# EAGLE design coil-driver-35 (EAGLE 4.16)
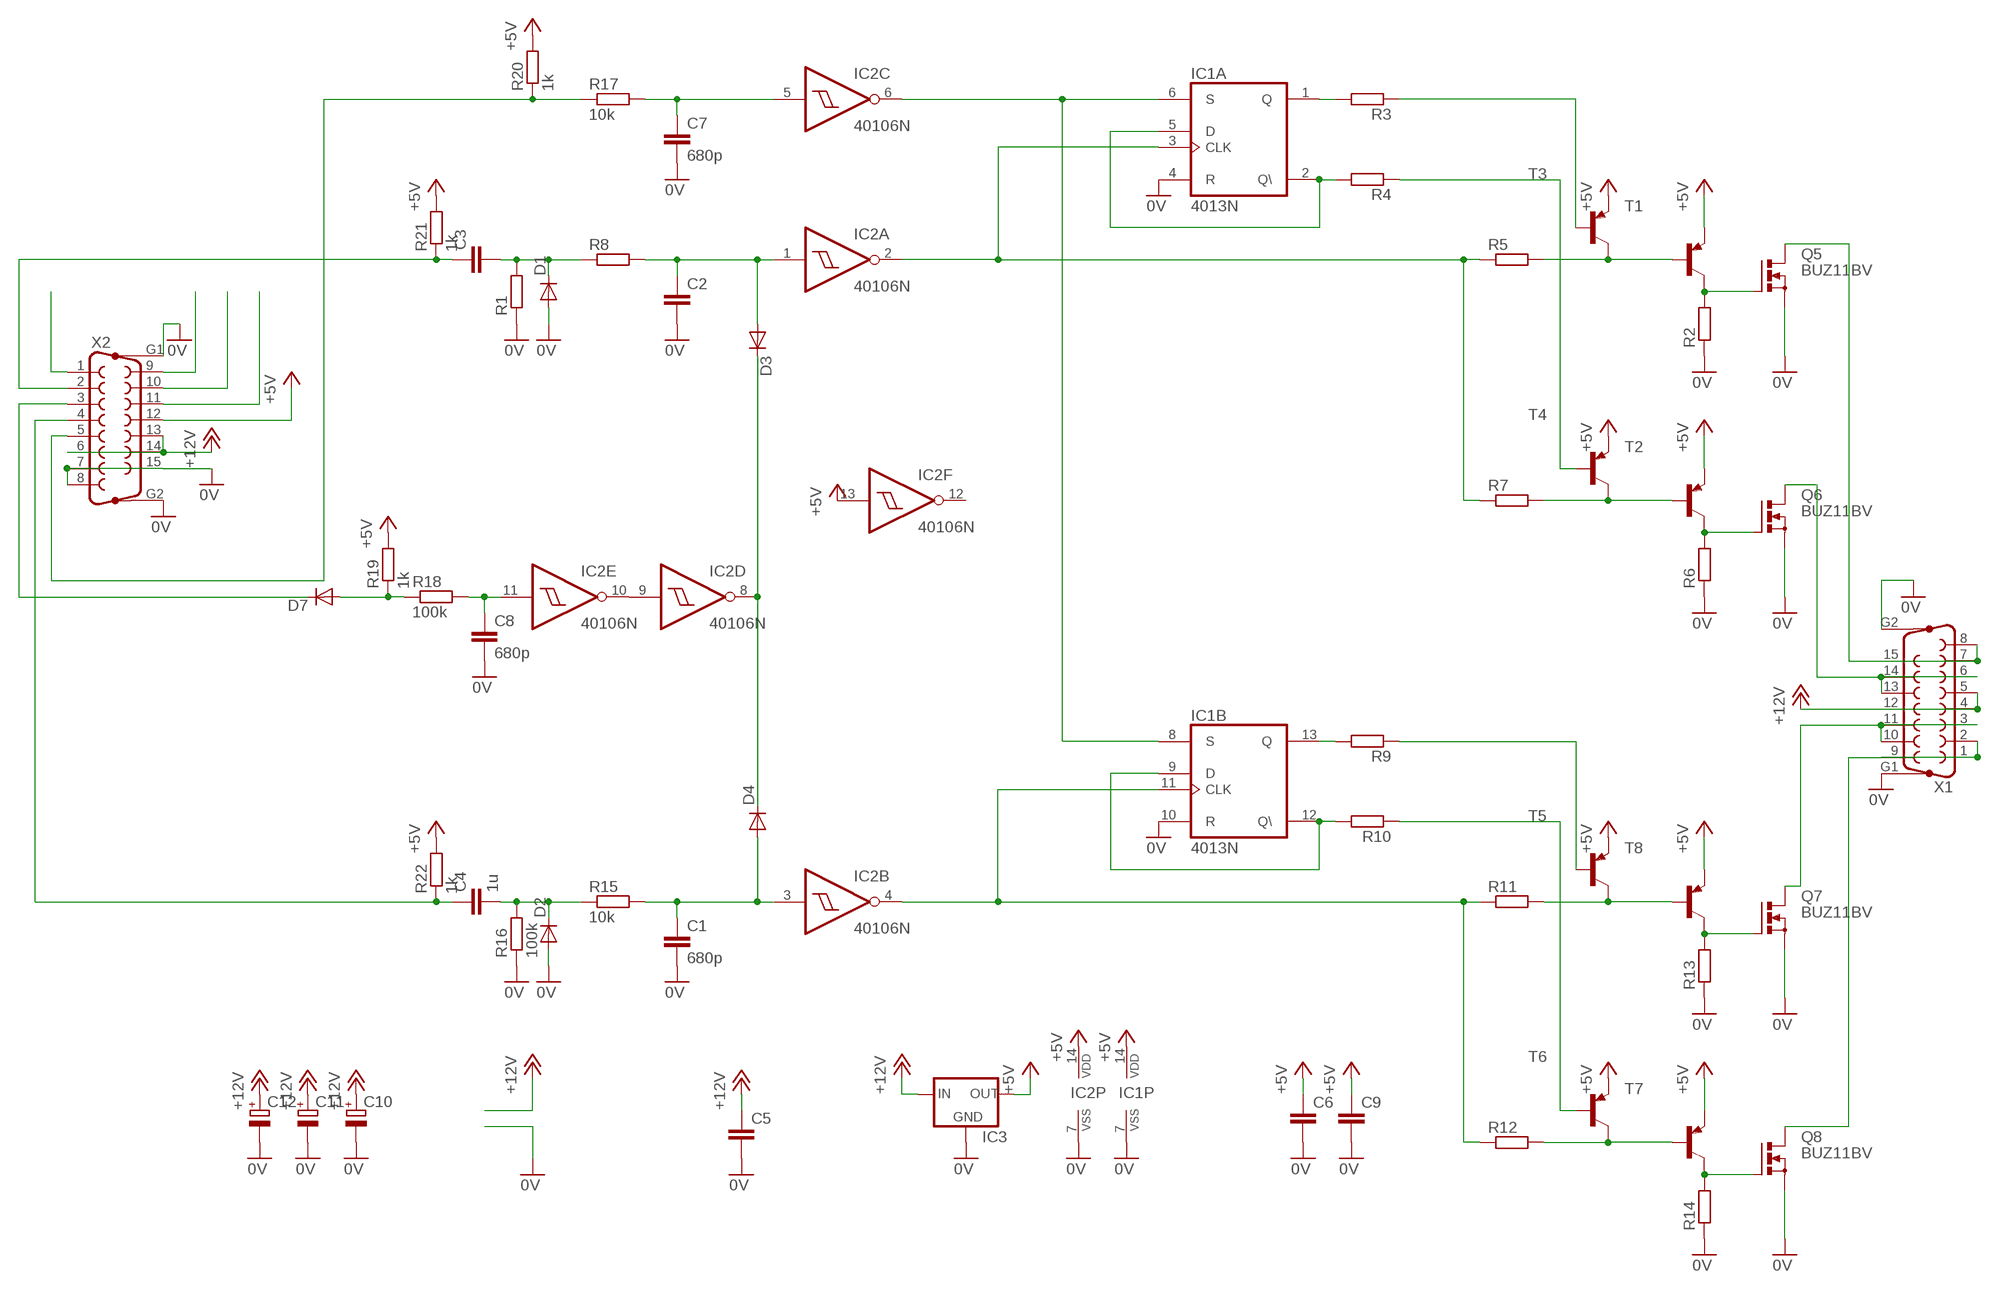
[diagram p0: schematic, sheet 1]

## Parts
C1  680p  C-EU050-030X075  [C050-030X075]
C2  C-EU050-030X075  [C050-030X075]
C3  C-EU050-030X075  [C050-030X075]
C4  1u  C-EU050-030X075  [C050-030X075]
C5  C-EU050-030X075  [C050-030X075]
C6  C-EU050-030X075  [C050-030X075]
C7  680p  C-EU050-030X075  [C050-030X075]
C8  680p  C-EU050-030X075  [C050-030X075]
C9  C-EU050-030X075  [C050-030X075]
C10  CPOL-EUE5-6  [E5-6]
C11  CPOL-EUE5-6  [E5-6]
C12  CPOL-EUE5-6  [E5-6]
D1  DIODE-D-7.5  [D-7.5]
D2  DIODE-D-7.5  [D-7.5]
D3  DIODE-D-7.5  [D-7.5]
D4  DIODE-D-7.5  [D-7.5]
D7  DIODE-D-7.5  [D-7.5]
IC1  4013N  [DIL14]
IC2  40106N  [DIL14]
IC3  78XXS  [78XXS]
Q5  BUZ11BV  [TO220BV]
Q6  BUZ11BV  [TO220BV]
Q7  BUZ11BV  [TO220BV]
Q8  BUZ11BV  [TO220BV]
R1  R-EU_0207/7  [0207/7]
R2  R-EU_0207/5V  [0207/5V]
R3  R-EU_0207/7  [0207/7]
R4  R-EU_0207/7  [0207/7]
R5  R-EU_0207/7  [0207/7]
R6  R-EU_0207/5V  [0207/5V]
R7  R-EU_0207/7  [0207/7]
R8  R-EU_0207/7  [0207/7]
R9  R-EU_0207/7  [0207/7]
R10  R-EU_0207/7  [0207/7]
R11  R-EU_0207/7  [0207/7]
R12  R-EU_0207/7  [0207/7]
R13  R-EU_0207/5V  [0207/5V]
R14  R-EU_0207/5V  [0207/5V]
R15  10k  R-EU_0207/7  [0207/7]
R16  100k  R-EU_0207/7  [0207/7]
R17  10k  R-EU_0207/7  [0207/7]
R18  100k  R-EU_0207/7  [0207/7]
R19  1k  R-EU_0207/7  [0207/7]
R20  1k  R-EU_0207/7  [0207/7]
R21  1k  R-EU_0207/7  [0207/7]
R22  1k  R-EU_0207/7  [0207/7]
T1  BC557B-PNP-TO92-EBC  [TO92-EBC]
T2  BC557B-PNP-TO92-EBC  [TO92-EBC]
T3  BC557B-PNP-TO92-EBC  [TO92-EBC]
T4  BC557B-PNP-TO92-EBC  [TO92-EBC]
T5  BC557B-PNP-TO92-EBC  [TO92-EBC]
T6  BC557B-PNP-TO92-EBC  [TO92-EBC]
T7  BC557B-PNP-TO92-EBC  [TO92-EBC]
T8  BC557B-PNP-TO92-EBC  [TO92-EBC]
X1  F15HP  [F15HP]
X2  F15HP  [F15HP]

## Nets
0V: C1.2 C2.2 C5.2 C6.2 C7.2 C8.2 C9.2 C10.- C11.- C12.- D1.A D2.A IC1.4(A:R) IC1.7(P:VSS) IC1.10(B:R) IC2.7(P:VSS) IC3.GND Q5.S Q6.S Q7.S Q8.S R1.1 R2.1 R6.1 R13.1 R14.1 R16.1 X1.G1 X1.G2 X2.7 X2.8 X2.15 X2.G1 X2.G2
+5V: C6.1 C9.1 IC1.14(P:VDD) IC2.13(F:I) IC2.14(P:VDD) IC3.OUT R19.2 R20.2 R21.2 R22.2 T1.E T2.E T3.E T4.E T5.E T6.E T7.E T8.E X2.12
+12V: C5.1 C10.+ C11.+ C12.+ IC3.IN X1.4 X1.5 X1.12 X2.6 X2.13 X2.14
N$1: Q5.G R2.2 T1.C
N$3: IC1.1(A:Q) R3.2
N$4: IC1.2(A:Q\) IC1.5(A:D) R4.2
N$5: R3.1 T3.B
N$6: IC1.3(A:CLK) IC2.2(A:O) R5.1 R7.1
N$8: C2.1 D3.A IC2.1(A:I) R8.2
N$9: Q6.G R6.2 T2.C
N$10: R4.1 T4.B
N$11: R5.2 T1.B T3.C
N$12: IC1.11(B:CLK) IC2.4(B:O) R11.1 R12.1
N$13: IC1.13(B:Q) R9.2
N$14: R7.2 T2.B T4.C
N$15: C3.2 D1.C R1.2 R8.1
N$16: IC1.9(B:D) IC1.12(B:Q\) R10.2
N$17: R9.1 T5.B
N$18: R10.1 T6.B
N$19: Q7.G R13.2 T8.C
N$20: R11.2 T5.C T8.B
N$21: R12.2 T6.C T7.B
N$22: Q8.G R14.2 T7.C
N$24: Q8.D X1.1 X1.2 X1.9
N$25: C4.2 D2.C R15.1 R16.2
N$26: C1.1 D4.A IC2.3(B:I) R15.2
N$27: C4.1 R22.1 X2.4
N$28: C3.1 R21.1 X2.2
N$29: IC1.6(A:S) IC1.8(B:S) IC2.6(C:O)
N$30: C7.1 IC2.5(C:I) R17.2
N$31: Q7.D X1.3 X1.10 X1.11
N$32: R17.1 R20.1 X2.5
N$35: Q6.D X1.6 X1.13 X1.14
N$36: Q5.D X1.7 X1.8 X1.15
N$37: IC2.9(D:I) IC2.10(E:O)
N$38: D7.C X2.3
N$39: C8.1 IC2.11(E:I) R18.2
N$40: D3.C D4.C IC2.8(D:O)
N$46: D7.A R18.1 R19.1
N$50: X2.9
N$51: X2.10
N$52: X2.11
N$53: X2.1
Unconnected: IC2.12(F:O)

## Library data of the parts
C1-C9 = rcl:C-EU: CAPACITOR, European symbol
C10-C12 = rcl:CPOL-EU: POLARIZED CAPACITOR, European symbol
D1-D4 D7 = diode:DIODE-: DIODE
IC1 = 40xx:4013: Dual D FLIP FLOP, set/reset
IC2 = 40xx:40106: Hex SCHMITT TRIGGER
IC3 = v-reg:78XXS: VOLTAGE REGULATOR
Q5-Q8 = transistor-power:BUZ11: N-CHANNEL MOS FET
R1-R22 = rcl:R-EU_: RESISTOR, European symbol
T1-T8 = transistor:*-PNP-: PNP Transistror
X1 X2 = con-subd:F15HP: SUB-D

## Board
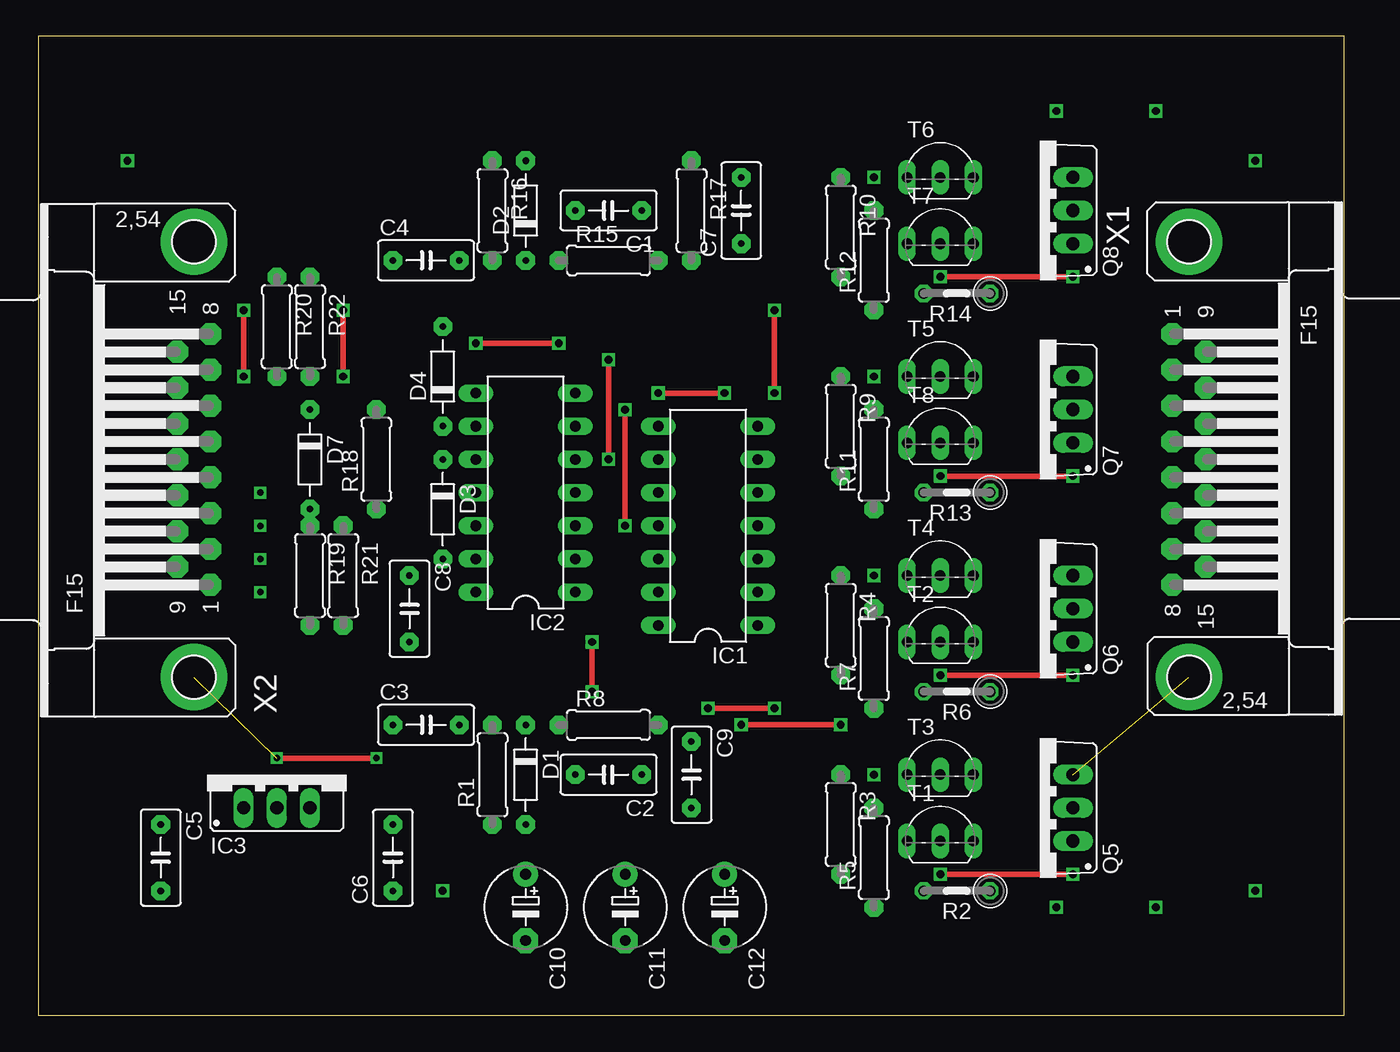
[diagram p1: board, top side]
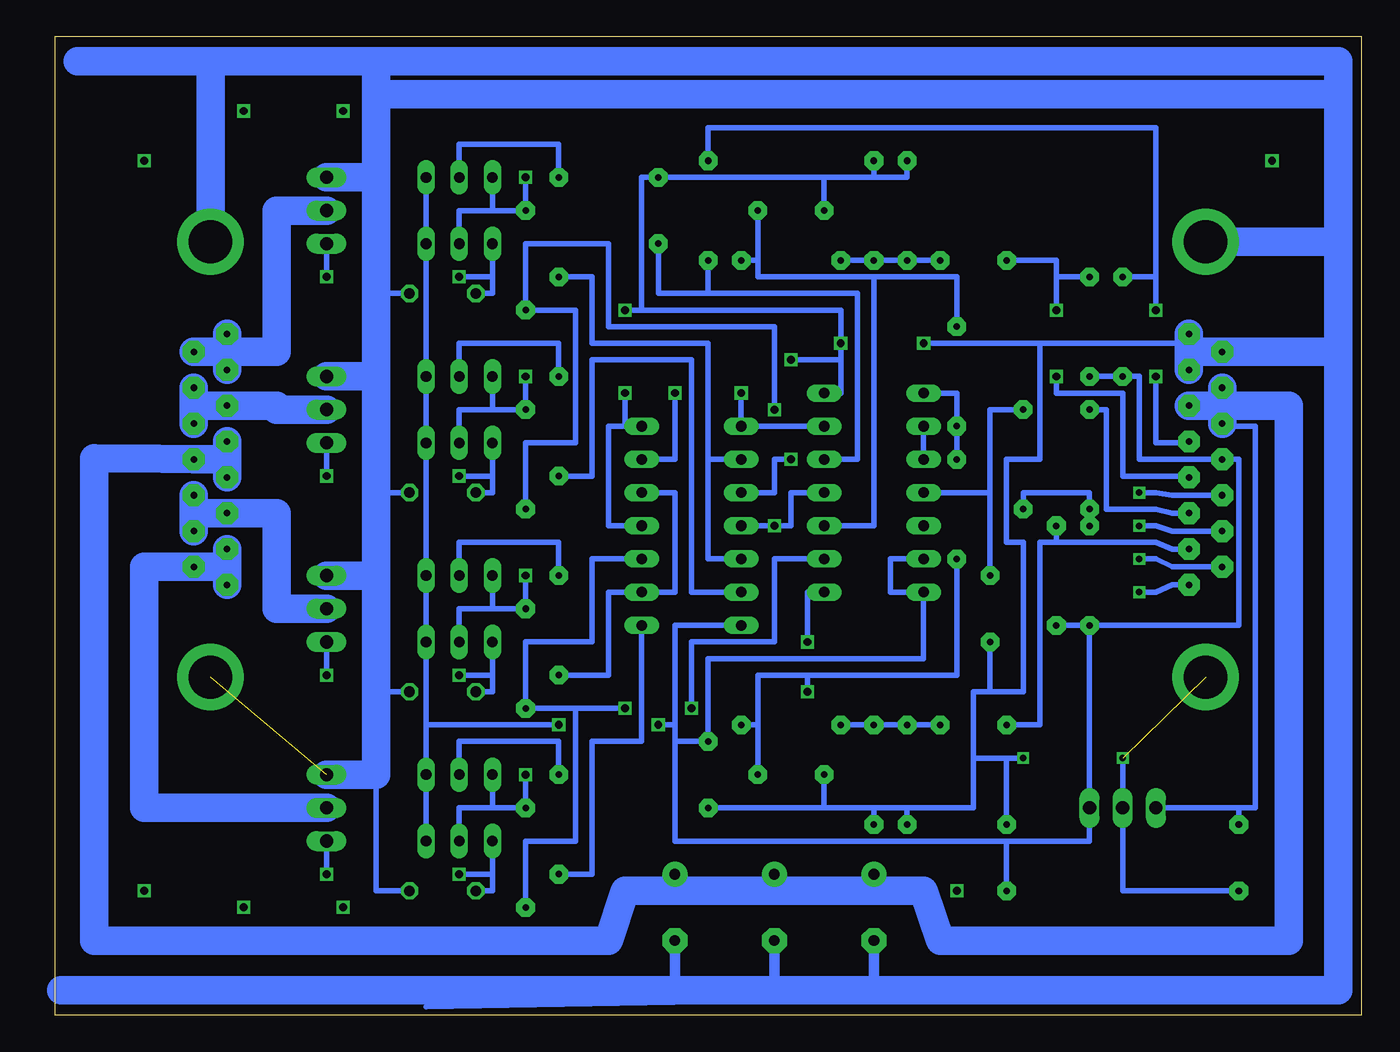
[diagram p2: board, bottom side, seen from below]

Size 100 x 74.92 mm. Coordinates in mm from the lower left corner, seen from the top.
Outline: 0,0 100,0 100,74.92 0,74.92 0,0
Copper layers (1*16): Top 0.035mm / dielectric 1.5mm / Bottom 0.035mm
Design rules "default": minimum track width 10mil, minimum drill 24mil, track to track 8mil, track to pad 8mil, pad to pad 8mil, via to via 8mil, smd to smd 8mil, copper to edge 40mil, drill to drill 8mil, minimum pad ring 10mil, minimum via ring 8mil, stop-mask expansion 4mil, vias tented up to drill 0mil, thermal gap 10mil
tKeepout: area 0.5,70.5 to 99.5,75.6; area 0.5,-0.6 to 99.5,4.4

### Footprints (pad centres in the part's own frame; a part is rotated, then mirrored left to right if it is on the bottom)
C050-030X075 = drill 0.5 pad 1.422 octagon: 1 -2.54,0; 2 2.54,0
E5-6 = drill 0.813 pad 1.905 round: + -2.54,0 | drill 0.813 pad 1.905 octagon: - 2.54,0
D-7.5 = drill 0.5 pad 1.422 octagon: A 3.81,0; C -3.81,0
DIL14 = drill 0.813 long: 1 -7.62,-3.81; 2 -5.08,-3.81; 3 -2.54,-3.81; 4 0,-3.81; 5 2.54,-3.81; 6 5.08,-3.81; 7 7.62,-3.81; 8 7.62,3.81; 9 5.08,3.81; 10 2.54,3.81; 11 0,3.81; 12 -2.54,3.81; 13 -5.08,3.81; 14 -7.62,3.81
78XXS = drill 1.016 long: GND 0,-2.54; IN -2.54,-2.54; OUT 2.54,-2.54
TO220BV = drill 1.016 long: D 0,-2.54; G -2.54,-2.54; S 2.54,-2.54
0207/7 = drill 0.5 pad 1.422 octagon: 1 -3.81,0; 2 3.81,0
0207/5V = drill 0.813 octagon: 1 -2.54,0; 2 2.54,0
TO92-EBC = drill 0.813 long: B 0,-1.27; C -2.54,-1.27; E 2.54,-1.27
F15HP = drill 0.5 pad 1.676 octagon: 1 -9.601,-1.27; 2 -6.858,-1.27; 3 -4.115,-1.27; 4 -1.372,-1.27; 5 1.372,-1.27; 6 4.115,-1.27; 7 6.858,-1.27; 8 9.601,-1.27; 9 -8.23,1.27; 10 -5.486,1.27; 11 -2.743,1.27; 12 0,1.27; 13 2.743,1.27; 14 5.486,1.27; 15 8.23,1.27 | drill 3.302 pad 5.08 round: G1 -16.662,0; G2 16.662,0

### Placement (x,y rotation side)
C1  43.65,61.59 180 top
C2  43.65,18.41 180 top
C3  29.68,22.22 0 top
C4  29.68,57.78 0 top
C5  9.36,12.06 270 top
C6  27.14,12.06 90 top
C7  53.81,61.59 90 top
C8  28.41,31.11 270 top
C9  50,18.41 270 top
C10  37.3,8.25 270 top
C11  44.92,8.25 270 top
C12  52.54,8.25 270 top
D1  37.3,18.41 270 top
D2  37.3,61.59 90 top
D3  30.95,38.73 270 top
D4  30.95,48.89 90 top
D7  20.79,42.54 270 top
IC1  51.27,37.46 90 top
IC2  37.3,40 90 top
IC3  18.25,18.41 0 top
Q5  76.67,15.87 90 top
Q6  76.67,31.11 90 top
Q7  76.67,46.35 90 top
Q8  76.67,61.59 90 top
R1  34.76,18.41 90 top
R2  70.32,9.52 180 top
R3  61.43,14.6 270 top
R4  61.43,29.84 270 top
R5  63.97,12.06 90 top
R6  70.32,24.76 180 top
R7  63.97,27.3 90 top
R8  43.65,22.22 0 top
R9  61.43,45.08 270 top
R10  61.43,60.32 270 top
R11  63.97,42.54 90 top
R12  63.97,57.78 90 top
R13  70.32,40 180 top
R14  70.32,55.24 180 top
R15  43.65,57.78 0 top
R16  34.76,61.59 270 top
R17  50,61.59 270 top
R18  25.87,42.54 90 top
R19  20.79,33.65 270 top
R20  18.25,52.7 270 top
R21  23.33,33.65 270 top
R22  20.79,52.7 270 top
T1  69.05,14.6 0 top
T2  69.05,29.84 0 top
T3  69.05,19.68 0 top
T4  69.05,34.92 0 top
T5  69.05,50.16 0 top
T6  69.05,65.4 0 top
T7  69.05,60.32 0 top
T8  69.05,45.08 0 top
X1  88.1,42.54 270 top
X2  11.9,42.54 90 top

### Tracks (layer width: path | path; a pad name or v marks a point on that pad's centre or on a via)
0V  (via drill 0.5, 0.6)  (2 unrouted)
  Top 0.406: v56.35,53.97 v56.35,47.62 | v33.49,51.43 v39.84,51.43 | v25.87,19.68 v18.25,19.68 | v43.65,50.16 v43.65,42.54
  Bottom 0.406: 37.3,64.13 34.76,64.13 R16.1 | 41.11,64.13 37.3,64.13 | 37.3,64.13 D2.A | 34.76,15.87 37.3,15.87 | 37.3,15.87 41.11,15.87 | 41.11,15.87 C2.2 | 34.76,15.87 R1.1 | 37.3,15.87 D1.A | X2.7 13.17,48.89 | 1.74,1.9 71.59,0.63 | 1.74,51.43 1.74,50.77 | 13.17,50.77 13.17,51.43 24.6,51.43 | 1.74,59.05 1.74,59.2 | C5.2 18.25,9.52 IC3.GND v18.25,19.68 | 75.4,55.24 R14.1 | 75.4,40 R13.1 | 75.4,24.76 R6.1 | R2.1 75.4,9.52 75.4,18.41 | IC1.4 57.62,37.46 57.62,45.08 IC1.7 56.35,45.08 v56.35,47.62 | 28.41,24.76 25.87,24.76 25.87,36.19 27.14,36.19 27.14,42.54 24.6,42.54 24.6,51.43 | 28.41,24.76 C8.2 | 28.41,24.76 29.68,24.76 29.68,19.68 | 34.76,15.87 29.68,15.87 29.68,19.68 | 41.11,64.13 C1.2 | 41.11,64.13 C7.2 55.08,64.13 55.08,53.97 v56.35,53.97 39.84,53.97 v39.84,51.43 39.84,50.16 | 41.11,15.87 C9.2 | 29.68,19.68 27.14,19.68 | 27.14,19.68 v25.87,19.68 | 27.14,19.68 C6.2 | IC2.7 39.84,47.62 39.84,50.16 | IC1.10 44.92,40 44.92,42.54 v43.65,42.54 | 39.84,50.16 v43.65,50.16 | 24.6,51.43 v33.49,51.43
  Bottom 0.813: 37.3,1.9 C10.- | 44.92,1.9 C11.- | 52.54,1.9 C12.-
  Bottom 2.184: 75.4,33.65 75.4,24.76 75.4,18.41 Q5.S | 75.4,48.89 75.4,40 75.4,33.65 | 75.4,64.13 75.4,55.24 75.4,48.89 | 75.4,64.13 Q8.S | 75.4,48.89 Q7.S | 75.4,33.65 Q6.S | X2.7 13.17,51.43 X2.8 | 75.4,73.02 1.74,73.02 1.74,70.48 | 75.4,70.48 75.4,73.02 | 75.4,70.48 75.4,64.13 | 88.1,73.02 98.26,73.02 | 1.74,70.48 1.74,59.05 1.74,51.43 1.74,1.9 37.3,1.9 44.92,1.9 52.54,1.9 99.53,1.9 | 1.74,50.77 X2.15 13.17,50.77 | 1.74,59.2 X2.G2 | 75.4,73.02 88.1,73.02 | 88.1,73.02 X1.G1 | 1.74,70.48 75.4,70.48
+5V  (via drill 0.6)
  Top 0.406: v53.81,22.22 v61.43,22.22
  Bottom 0.406: T7.E T6.E T7.E | T8.E T5.E | T5.E T7.E | IC1.14 52.54,29.84 52.54,22.22 | T1.E T3.E 71.59,22.22 | T4.E T2.E 71.59,22.22 | T4.E T8.E | 52.54,20.95 52.54,13.33 27.14,13.33 | 52.54,20.95 52.54,22.22 | 27.14,13.33 20.79,13.33 IC3.OUT R19.2 | R19.2 9.36,29.84 9.36,42.54 X2.12 16.98,42.54 16.98,48.89 R20.2 R22.2 | 52.54,20.95 C9.1 50,27.3 33.49,27.3 IC2.14 36.03,32.38 36.03,34.92 IC2.13 | v61.43,22.22 71.59,22.22 | 52.54,22.22 v53.81,22.22 | T8.E T5.E | T4.E T5.E | 27.14,13.33 C6.1 | R19.2 R21.2
+12V
  Bottom 0.406: X2.6 13.17,46.35 | 8.09,15.87 9.36,15.87 C5.1 | 8.09,15.87 IC3.IN | 8.09,15.87 8.09,45.08 10.63,45.08 X2.13
  Bottom 0.813: 37.3,9.52 C10.+ | 44.92,9.52 C11.+ | 52.54,9.52 C12.+
  Bottom 2.184: 86.83,42.54 X1.5 | 86.83,42.54 X1.12 | 86.83,42.54 96.99,42.64 96.99,5.71 57.62,5.71 56.35,9.52 52.54,9.52 44.92,9.52 37.3,9.52 33.49,9.52 32.22,5.71 5.55,5.71 5.55,46.66 X2.6 10.63,46.66 10.63,46.35 | 86.83,42.54 X1.4 | 10.63,46.35 X2.13 | 10.63,46.35 X2.14
N$1  (via drill 0.6)
  Top 0.406: v69.05,10.79 v79.21,10.79
  Bottom 0.406: v79.21,10.79 Q5.G | R2.2 66.51,9.52 66.51,10.79 | 66.51,10.79 v69.05,10.79 | 66.51,10.79 T1.C
N$2  (via drill 0.6)
  other vias: 77.94,8.25
N$3
  Bottom 0.406: R3.2 58.89,10.79 58.89,20.95 55.08,20.95 IC1.1
N$4
  Bottom 0.406: R4.2 57.62,26.03 57.62,32.38 IC1.2 52.54,32.38 52.54,40 IC1.5
N$5
  Bottom 0.406: T3.B 69.05,20.95 61.43,20.95 R3.1
N$6  (via drill 0.6)
  Top 0.406: v56.35,23.49 v51.27,23.49
  Bottom 0.406: IC1.3 58.89,34.92 58.89,28.57 63.97,28.57 R7.1 | R7.1 v56.35,23.49 | v51.27,23.49 51.27,28.57 44.92,28.57 44.92,34.92 IC2.2 | R7.1 60.16,23.49 60.16,13.33 63.97,13.33 R5.1
N$7  (via drill 0.6)
  other vias: 85.56,8.25
N$8  (via drill 0.6)
  Top 0.406: v42.38,24.76 v42.38,28.57
  Bottom 0.406: 46.19,22.22 C2.1 | 46.19,22.22 R8.2 | 46.19,22.22 46.19,26.03 42.38,26.03 | D3.A 30.95,26.03 42.38,26.03 | IC2.1 42.38,32.38 v42.38,28.57 | 42.38,26.03 v42.38,24.76
N$9  (via drill 0.6)
  Top 0.406: v69.05,26.03 v79.21,26.03
  Bottom 0.406: 66.51,26.03 T2.C | v79.21,26.03 Q6.G | 66.51,26.03 v69.05,26.03 | R6.2 66.51,24.76 66.51,26.03
N$10
  Bottom 0.406: T4.B 69.05,36.19 61.43,36.19 R4.1
N$11  (via drill 0.6)
  Bottom 0.406: 66.51,15.87 T3.C | 66.51,15.87 69.05,15.87 T1.B | 66.51,15.87 R5.2 v63.97,18.41
N$12  (via drill 0.6)
  Top 0.406: v44.92,37.46 v44.92,46.35
  Bottom 0.406: v44.92,46.35 44.92,52.7 57.62,52.7 57.62,59.05 63.97,59.05 R12.1 60.16,53.97 60.16,43.81 63.97,43.81 R11.1 | IC1.11 v44.92,37.46 43.65,37.46 43.65,40 IC2.4
N$13
  Bottom 0.406: R9.2 58.89,41.27 58.89,50.16 51.27,50.16 51.27,32.38 IC1.13
N$14  (via drill 0.6)
  Bottom 0.406: 66.51,31.11 T4.C | 66.51,31.11 69.05,31.11 T2.B | 66.51,31.11 R7.2 v63.97,33.65
N$15
  Bottom 0.406: R1.2 38.57,22.22 | C3.2 R1.2 | R1.2 D1.C R8.1
N$16
  Bottom 0.406: 50,42.54 50,51.43 58.89,51.43 58.89,56.51 R10.2 | 50,42.54 IC1.9 | IC1.12 50,34.92 50,42.54
N$17
  Bottom 0.406: T5.B 69.05,51.43 61.43,51.43 R9.1
N$18
  Bottom 0.406: T6.B 69.05,66.67 61.43,66.67 R10.1
N$19  (via drill 0.6)
  Top 0.406: v69.05,41.27 v79.21,41.27
  Bottom 0.406: v79.21,41.27 Q7.G | R13.2 66.51,40 66.51,41.27 | 66.51,41.27 T8.C | 66.51,41.27 v69.05,41.27
N$20  (via drill 0.6)
  Bottom 0.406: 66.51,46.35 T5.C | 66.51,46.35 69.05,46.35 T8.B | 66.51,46.35 R11.2 v63.97,48.89
N$21  (via drill 0.6)
  Bottom 0.406: 66.51,61.59 T6.C | 66.51,61.59 69.05,61.59 T7.B | 66.51,61.59 R12.2 v63.97,64.13
N$22  (via drill 0.6)
  Top 0.406: v69.05,56.51 v79.21,56.51
  Bottom 0.406: v79.21,56.51 Q8.G | R14.2 66.51,55.24 66.51,56.51 | 66.51,56.51 T7.C | 66.51,56.51 v69.05,56.51
N$23  (via drill 0.6)
  other vias: 77.94,69.21
N$24
  Bottom 2.184: Q8.D 83.02,61.59 83.02,50.77 X1.9 86.83,50.77 86.83,51.43 | 86.83,51.43 X1.2 | 86.83,51.43 X1.1
N$25
  Bottom 0.406: C4.2 R16.2 | R16.2 38.57,57.78 | R16.2 D2.C R15.1
N$26
  Bottom 0.406: 46.19,57.78 R15.2 | 46.19,57.78 C1.1 | 46.19,57.78 46.19,56.51 37.3,56.51 | 37.3,56.51 30.95,56.51 D4.A | IC2.3 37.3,37.46 37.3,56.51
N$27  (via drill 0.6)
  Top 0.406: v23.33,48.89 v23.33,53.97
  Bottom 0.406: X2.4 13.17,41.27 18.25,41.27 18.25,47.62 23.33,47.62 v23.33,48.89 | C4.1 23.33,57.78 23.33,56.51 | v23.33,53.97 23.33,56.51 | 23.33,56.51 R22.1
N$28
  Bottom 0.406: X2.2 14.44,35.68 15.71,36.19 23.33,36.19 | 23.33,36.19 24.6,36.19 24.6,22.22 C3.1 | 23.33,36.19 R21.1
N$29  (via drill 0.6)
  Top 0.406: v47.46,47.62 v52.54,47.62
  Bottom 0.406: IC1.6 52.54,42.54 v52.54,47.62 | v47.46,47.62 IC1.8 IC2.6
N$30
  Bottom 0.406: 50,55.24 38.57,55.24 38.57,42.54 IC2.5 | 50,55.24 R17.2 | 50,55.24 53.81,55.24 C7.1
N$31
  Bottom 0.406: X1.11 89.37,45.08
  Bottom 2.184: 89.37,46.35 X1.11 | 89.37,46.35 X1.10 | Q7.D 83.02,46.35 83.02,46.66 X1.3 89.37,46.66 89.37,46.35
N$32  (via drill 0.6)
  Top 0.406: v15.71,48.89 v15.71,53.97
  Bottom 0.406: X2.5 13.17,43.81 15.71,43.81 v15.71,48.89 | v15.71,53.97 15.71,56.51 | 15.71,56.51 15.71,67.94 50,67.94 R17.1 | 15.71,56.51 R20.1
N$33  (via drill 0.6)
  other vias: 85.56,69.21
N$34  (via drill 0.6)
  other vias: 93.18,9.52
N$35
  Bottom 2.184: 89.37,37.46 X1.13 | Q6.D 83.02,31.11 83.02,38.43 X1.6 89.37,38.43 89.37,37.46 | 89.37,37.46 X1.14
N$36
  Bottom 0.406: X1.7 86.83,36.19
  Bottom 2.184: 86.83,34.92 X1.7 | 86.83,34.31 86.83,34.92 | 86.83,33.65 X1.8 | 86.83,34.92 86.83,33.65 | Q5.D 93.18,15.87 93.18,34.31 X1.15 86.83,34.31 | 86.83,34.31 86.83,33.65
N$37
  Bottom 0.406: IC2.10 IC2.9
N$38
  Bottom 0.406: X2.3 14.44,38.43 15.71,38.73 19.52,38.73 19.52,46.35 D7.C
N$39
  Bottom 0.406: 28.41,40 IC2.11 | C8.1 28.41,40 | R18.2 28.41,46.35 28.41,40
N$40
  Bottom 0.406: D4.C D3.C D4.C | D4.C 30.95,47.62 IC2.8
N$41  (via drill 0.6)
  other vias: 93.18,65.4
N$42  (via drill 0.6)
  other vias: 6.82,65.4
N$43  (via drill 0.6)
  other vias: 30.95,9.52
N$46
  Bottom 0.406: R18.1 25.87,40 20.79,40 D7.A R19.1
N$48  (via drill 0.5)
  other vias: 16.98,40
N$49  (via drill 0.5)
  other vias: 16.98,37.46
N$50
  Bottom 0.406: X2.9 14.44,34.31 15.71,34.92 16.98,34.92
N$51
  Bottom 0.406: X2.10 14.44,37.05 15.71,37.46 16.98,37.46
N$52
  Bottom 0.406: X2.11 14.44,39.8 15.71,40 16.98,40 16.98,39.8
N$53
  Bottom 0.406: X2.1 14.44,32.94 15.71,32.38 16.98,32.38
N$54  (via drill 0.5)
  other vias: 16.98,34.92
N$55  (via drill 0.5)
  other vias: 16.98,32.38